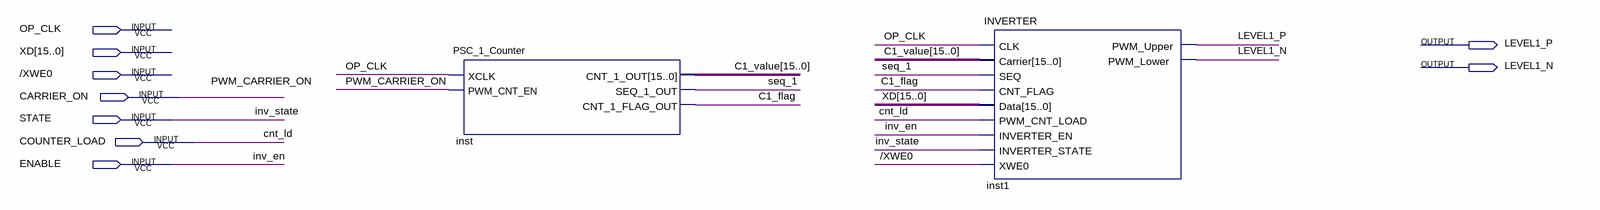
[diagram p0: schematic sheet]
// Quartus schematic INVERTER_LEVEL10.bdf as structural Verilog: 2 symbols, 9 pins
module INVERTER_LEVEL10 (
  input  OP_CLK,
  input  [15:0] XD,
  input  \/XWE0 ,
  input  CARRIER_ON,
  input  STATE,
  input  COUNTER_LOAD,
  input  ENABLE,
  output LEVEL1_P,
  output LEVEL1_N
);

  wire C1_flag, seq_1;
  wire [15:0] C1_value;

  PSC_1_Counter inst (
    .XCLK(OP_CLK), .PWM_CNT_EN(CARRIER_ON), .CNT_1_OUT(C1_value), .SEQ_1_OUT(seq_1), .CNT_1_FLAG_OUT(C1_flag));
  INVERTER inst1 (
    .CLK(OP_CLK), .Carrier(C1_value), .SEQ(seq_1), .CNT_FLAG(C1_flag), .Data(XD),
    .PWM_CNT_LOAD(COUNTER_LOAD), .INVERTER_EN(ENABLE), .INVERTER_STATE(STATE), .XWE0(\/XWE0 ),
    .PWM_Upper(LEVEL1_P), .PWM_Lower(LEVEL1_N));

  // Other names for the same wires on the sheet: cnt_ld = COUNTER_LOAD; inv_en = ENABLE; inv_state = STATE;
  //   PWM_CARRIER_ON = CARRIER_ON
endmodule
